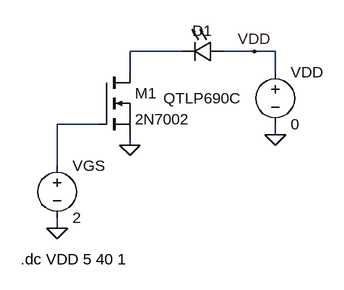
[diagram p0: schematic MOSFET 2N7002 Fonte Corrente LED.asc]
MOSFET 2N7002 Fonte Corrente LED.asc, the LTspice schematic file:
Version 4
SHEET 1 880 680
WIRE 256 32 176 32
WIRE 368 32 320 32
WIRE 400 32 368 32
WIRE 176 64 176 32
WIRE 400 64 400 32
WIRE 128 144 64 144
WIRE 400 160 400 144
WIRE 176 176 176 160
WIRE 64 208 64 144
WIRE 64 304 64 288
FLAG 64 304 0
FLAG 176 176 0
FLAG 400 160 0
FLAG 368 32 VDD
SYMBOL nmos 128 64 R0
SYMATTR InstName M1
SYMATTR Value 2N7002
SYMBOL voltage 400 48 R0
WINDOW 123 0 0 Left 0
WINDOW 39 0 0 Left 0
SYMATTR InstName VDD
SYMATTR Value 0
SYMBOL voltage 64 192 R0
WINDOW 123 0 0 Left 0
WINDOW 39 0 0 Left 0
SYMATTR InstName VGS
SYMATTR Value 2
SYMBOL LED 320 16 R90
WINDOW 0 0 32 VBottom 2
WINDOW 3 72 32 VTop 2
SYMATTR InstName D1
SYMATTR Value QTLP690C
TEXT 8 352 Left 2 !.dc VDD 5 40 1

The netlist it stands for:
* MOSFET 2N7002 Fonte Corrente LED.asc
M1 N001 N002 0 0 2N7002
VDD VDD 0 0
VGS N002 0 2
D1 VDD N001 QTLP690C
.model D D
.lib standard.dio
.model NMOS NMOS
.model PMOS PMOS
.lib standard.mos
.dc VDD 5 40 1
.backanno
.end